# EasyEDA Pro project ProPrj_PCB_PCB_PCB_PCB_STM32F103C8T6(gift)_2023-09-09_2023-10-22_2024-01-15_2025-05-12.epro, schematic Schematic1
Board Name: 底板; Create Date: 2025-03-19; Page Name: P1; Project Name: PCB_PCB_PCB_PCB_STM32F103C8T6(gift)_2023-09-09_2023-10-22_2024-01-15; Schematic Name: Schematic1; Update Date: 2025-03-19; Company: Matrixchung; Page Size: Custom; Version: V1.0
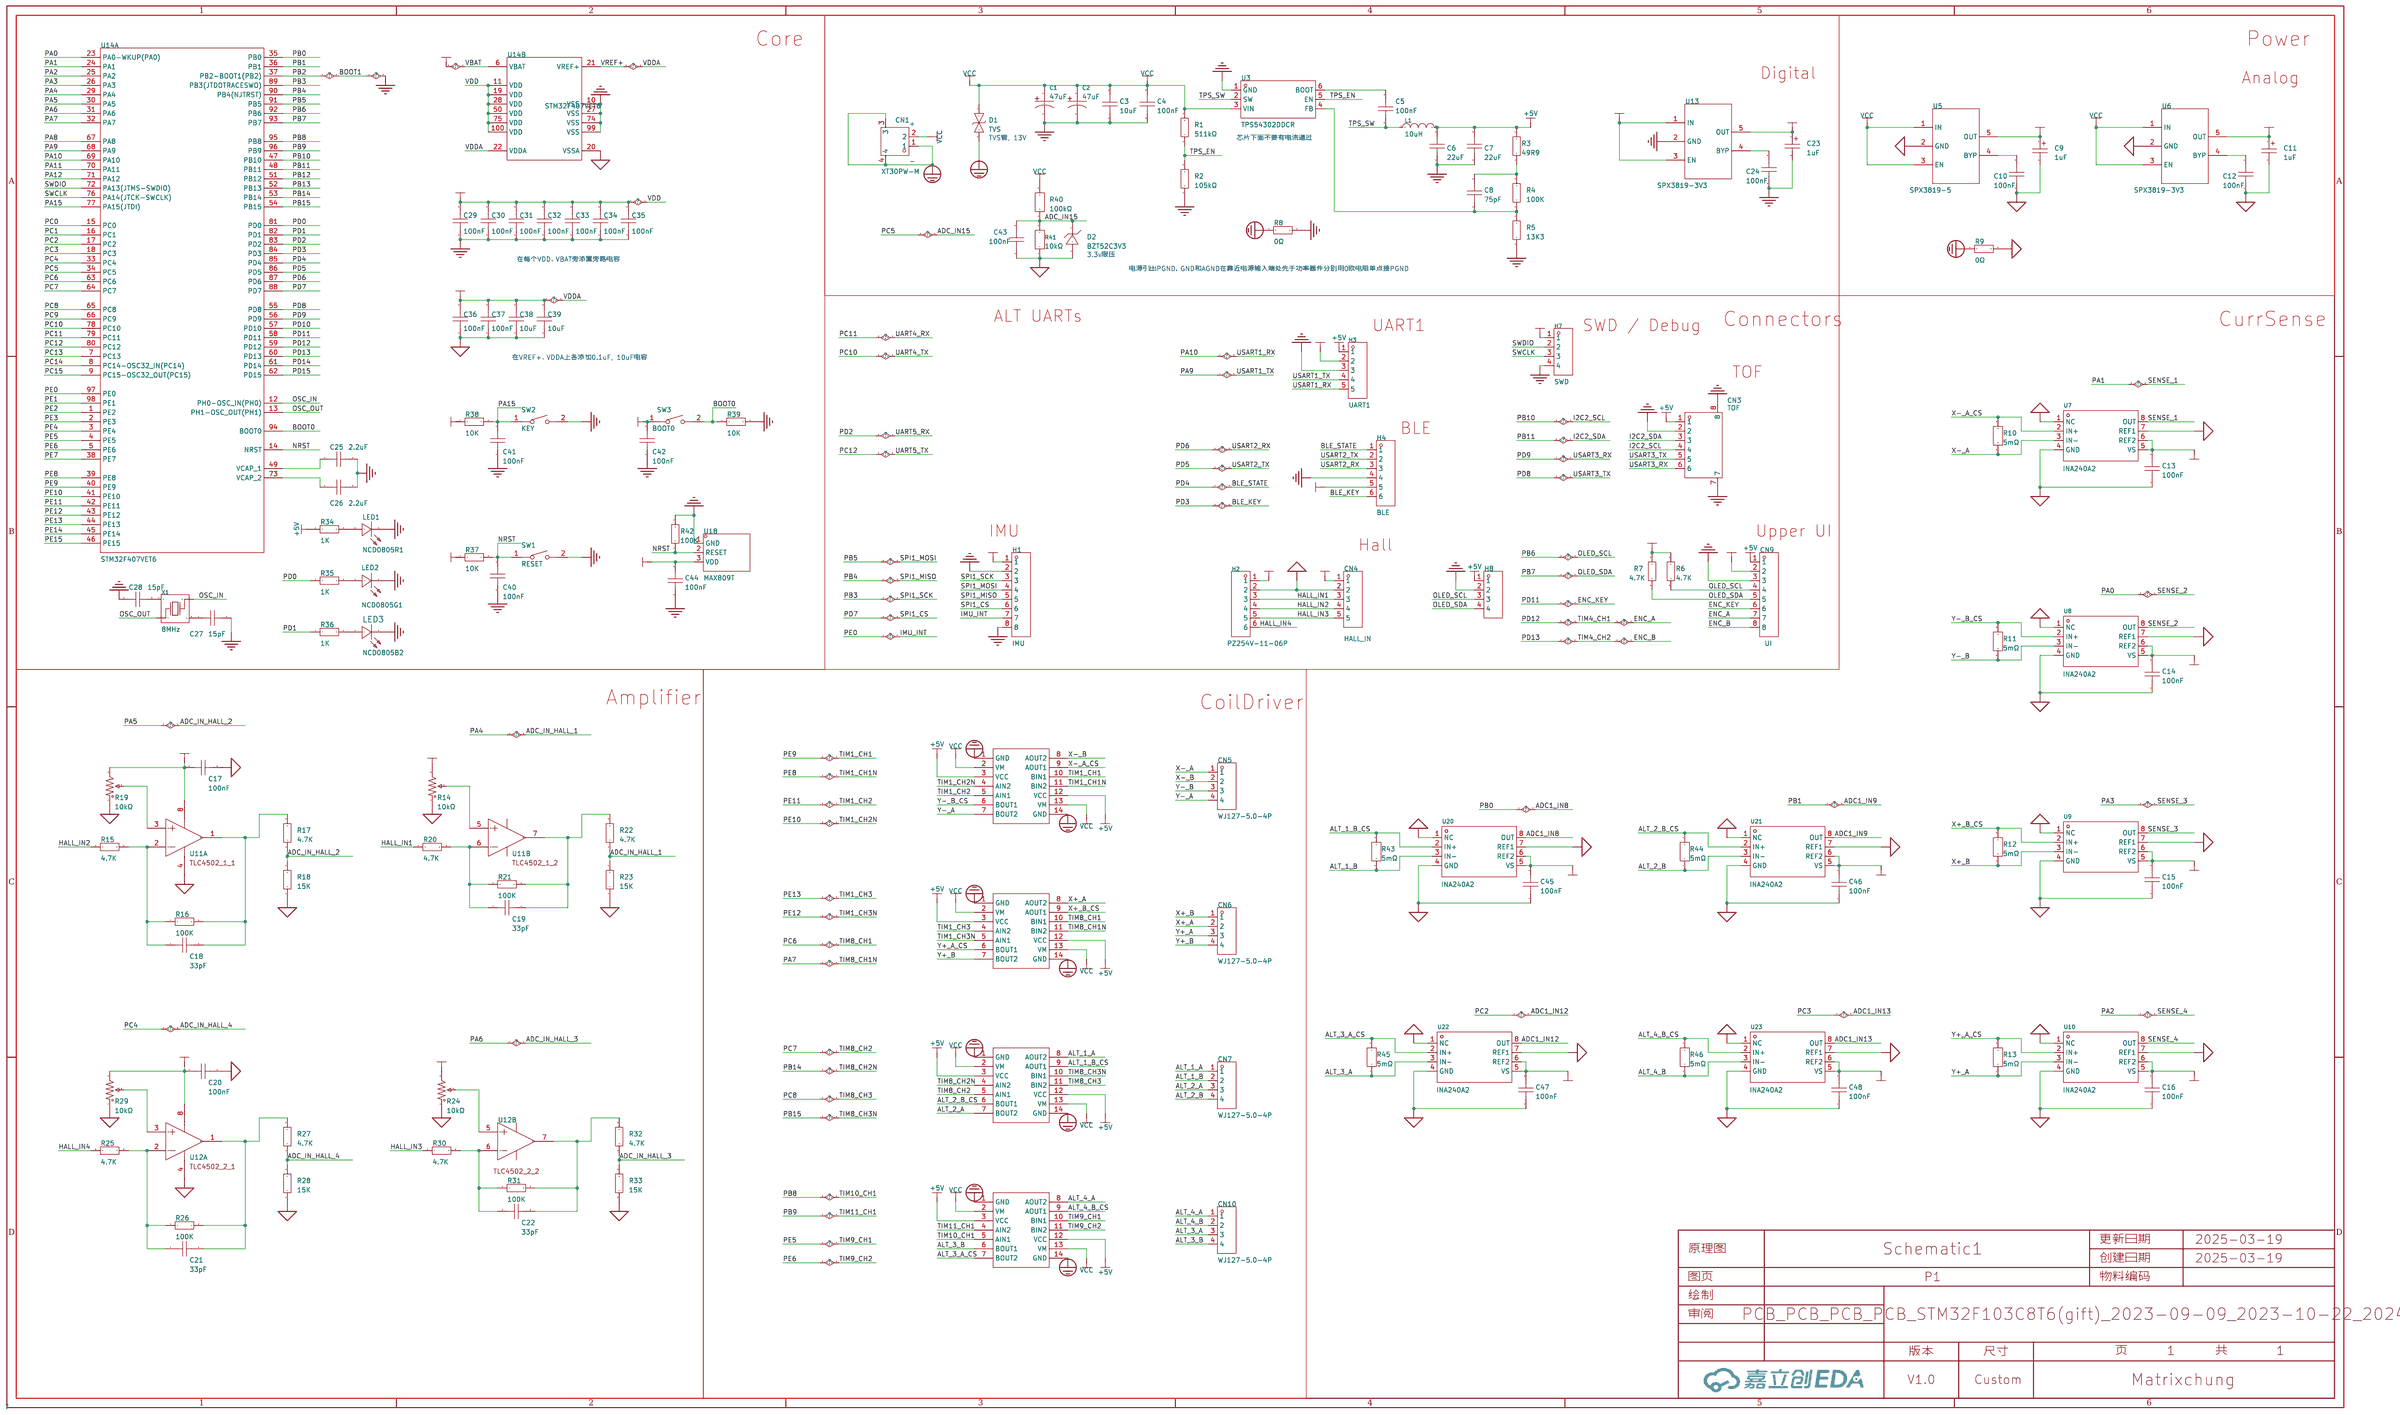
[diagram p0: schematic sheet]

## Parts
C1  47uF  [CAP-SMD_BD6.3-L6.6-W6.6-LS7.6-FD]
C2  47uF  [CAP-SMD_BD6.3-L6.6-W6.6-LS7.6-FD]
C3  10uF  [C0603]
C4  100nF  [C0603]
C5  100nF  [C0603]
C6  22uF  [C0603]
C7  22uF  [C0603]
C8  75pF  [C0603]
C9  1uF  [CASE-A_3216]
C10  100nF  [C0603]
C11  1uF  [CASE-A_3216]
C12  100nF  [C0603]
C13  100nF  [C0603]
C14  100nF  [C0603]
C15  100nF  [C0603]
C16  100nF  [C0603]
C17  100nF  [C0603]
C18  33pF  [C0603]
C19  33pF  [C0603]
C20  100nF  [C0603]
C21  33pF  [C0603]
C22  33pF  [C0603]
C23  1uF  [CASE-A_3216]
C24  100nF  [C0603]
C25  2.2uF  [C0603]
C26  2.2uF  [C0603]
C27  15pF  [C0603]
C28  15pF  [C0603]
C29  100nF  [C0603]
C30  100nF  [C0603]
C31  100nF  [C0603]
C32  100nF  [C0603]
C33  100nF  [C0603]
C34  100nF  [C0603]
C35  100nF  [C0603]
C36  100nF  [C0603]
C37  100nF  [C0603]
C38  10uF  [C0603]
C39  10uF  [C0603]
C40  100nF  [C0603]
C41  100nF  [C0603]
C42  100nF  [C0603]
C43  100nF  [C0603]
C44  100nF  [C0603]
C45  100nF  [C0603]
C46  100nF  [C0603]
C47  100nF  [C0603]
C48  100nF  [C0603]
CN1  XT30PW-M  [CONN-TH_XT30PW-M]
CN3  TOF  [CONN-SMD_A1002WV-S-6P]
CN4  HALL_IN  [CONN-TH_5P-P2.50_HC-XHB-5A]
CN5  WJ127-5.0-4P  [CONN-TH_4P-P5.00_WJ127-5.0-4P]
CN6  WJ127-5.0-4P  [CONN-TH_4P-P5.00_WJ127-5.0-4P]
CN7  WJ127-5.0-4P  [CONN-TH_4P-P5.00_WJ127-5.0-4P]
CN9  UI  [CONN-TH_8P-P2.50_HCTL_HC-XHB-8A]
CN10  WJ127-5.0-4P  [CONN-TH_4P-P5.00_WJ127-5.0-4P]
D1  TVS  [SMB_L4.6-W3.6-LS5.4-BI]
D2  BZT52C3V3  [SOD-123_L2.7-W1.6-LS3.7-RD]
H1  IMU  [HDR-TH_8P-P2.54-V-F-3]
H2  PZ254V-11-06P  [HDR-TH_6P-P2.54-V-M]
H3  UART1  [HDR-TH_5P-P2.54-V-M]
H4  BLE  [HDR-TH_6P-P2.54-V-F]
H7  SWD  [HDR-TH_4P-P2.54-V-M]
H8  MF254V-11-04-1000-H70  [HDR-TH_4P-P2.54-V-F-3]
L1  10uH  [IND-SMD_L5.4-W5.2_FXL0530]
LED1  NCD0805R1  [LED0805-R-RD]
LED2  NCD0805G1  [LED0805-R-RD]
LED3  NCD0805B2  [LED0805-R-RD]
R1  511kΩ  [R0805]
R2  105kΩ  [R0805]
R3  49R9  [R0603]
R4  100K  [R0603]
R5  13K3  [R0603]
R6  4.7K  [R0603]
R7  4.7K  [R0603]
R8  0Ω  [R2512]
R9  0Ω  [R2512]
R10  5mΩ  [R2512]
R11  5mΩ  [R2512]
R12  5mΩ  [R2512]
R13  5mΩ  [R2512]
R14  10kΩ  [RES-ADJ-TH_3P-L10.0-W10.0-P2.50-L]
R15  4.7K  [R0603]
R16  100K  [R0603]
R17  4.7K  [R0603]
R18  15K  [R0603]
R19  10kΩ  [RES-ADJ-TH_3P-L10.0-W10.0-P2.50-L]
R20  4.7K  [R0603]
R21  100K  [R0603]
R22  4.7K  [R0603]
R23  15K  [R0603]
R24  10kΩ  [RES-ADJ-TH_3P-L10.0-W10.0-P2.50-L]
R25  4.7K  [R0603]
R26  100K  [R0603]
R27  4.7K  [R0603]
R28  15K  [R0603]
R29  10kΩ  [RES-ADJ-TH_3P-L10.0-W10.0-P2.50-L]
R30  4.7K  [R0603]
R31  100K  [R0603]
R32  4.7K  [R0603]
R33  15K  [R0603]
R34  1K  [R0603]
R35  1K  [R0603]
R36  1K  [R0603]
R37  10K  [R0603]
R38  10K  [R0603]
R39  10K  [R0603]
R40  100kΩ  [R0805]
R41  10kΩ  [R0603]
R42  100K  [R0603]
R43  5mΩ  [R2512]
R44  5mΩ  [R2512]
R45  5mΩ  [R2512]
R46  5mΩ  [R2512]
SW1  RESET  [SW-SMD_L3.9-W3.0-P4.45]
SW2  KEY  [SW-SMD_L3.9-W3.0-P4.45]
SW3  BOOT0  [SW-SMD_L3.9-W3.0-P4.45]
U3  TPS54302DDCR  [SOT-23-6_L2.9-W1.6-P0.95-LS2.8-BL]
U5  SPX3819-5  [SOT-23-5_L3.0-W1.7-P0.95-LS2.8-BL]
U6  SPX3819-3V3  [SOT-23-5_L3.0-W1.7-P0.95-LS2.8-BL]
U7  INA240A2  [TSSOP-8_L4.4-W3.0-P0.65-LS6.4-BL]
U8  INA240A2  [TSSOP-8_L4.4-W3.0-P0.65-LS6.4-BL]
U9  INA240A2  [TSSOP-8_L4.4-W3.0-P0.65-LS6.4-BL]
U10  INA240A2  [TSSOP-8_L4.4-W3.0-P0.65-LS6.4-BL]
U11  -  [DIP-8_L10.2-W10.2-P2.54-LS7.6-BL]  (sections 1,2)
U12  -  [DIP-8_L10.2-W10.2-P2.54-LS7.6-BL]  (sections 1,2)
U13  SPX3819-3V3  [SOT-23-5_L3.0-W1.7-P0.95-LS2.8-BL]
U14  STM32F407VET6  [LQFP-100_L14.0-W14.0-P0.50-LS16.0-BL]  (sections 1,2)
U15  AT8236  [AT8236-Dual-Module]
U16  AT8236  [AT8236-Dual-Module]
U17  AT8236  [AT8236-Dual-Module]
U18  MAX809T  [SOT-23-3_L2.9-W1.3-P1.90-LS2.4-BR]
U19  AT8236  [AT8236-Dual-Module]
U20  INA240A2  [TSSOP-8_L4.4-W3.0-P0.65-LS6.4-BL]
U21  INA240A2  [TSSOP-8_L4.4-W3.0-P0.65-LS6.4-BL]
U22  INA240A2  [TSSOP-8_L4.4-W3.0-P0.65-LS6.4-BL]
U23  INA240A2  [TSSOP-8_L4.4-W3.0-P0.65-LS6.4-BL]
X1  8MHz  [OSC-SMD_4P-L3.2-W2.5-BL]

## Library data of the parts
C1 C2 = VT1V470M0605: 容值:47uF;精度:±20%;额定电压:35V;纹波电流:66mA@120Hz;等效串联电阻:-;; LCSC Part Name: 47uF ±20% 35V; Supplier Part: C90276; Manufacturer: ROQANG(容强); Supplier Footprint: SMD,D6.3xL5.4mm; JLCPCB Part Class: 扩展库; Datasheet: https://atta.szlcsc.com/upload/public/pdf/source/20161207/1481104186053.pdf; Supplier: LCSC; Tolerance: ±20%; Rated Voltage: 35V; φD: 6.3mm; L: 5.4mm; Ripple Current: 66mA@120Hz; Lifetime @ Temp: 2000hrs@105℃; Operating Temperature: -40℃~+105℃
C3-C8 C10 C12-C22 C24-C48 = CAP_0603: Supplier Footprint: 0603
C9 C11 C23 = TAJA105K016RNJ: 容值:1uF;精度:±10%;额定电压:16V;等效串联电阻:11Ω;; LCSC Part Name: 1uF ±10% 16V; Supplier Part: C7174; Manufacturer: Kyocera AVX; Supplier Footprint: CASE-A-3216; JLCPCB Part Class: 扩展库; Datasheet: https://atta.szlcsc.com/upload/public/pdf/source/20160107/1457707748219.pdf; Supplier: LCSC; Tolerance: ±10%; Rated Voltage: 16V; Equivalent Series Resistance(ESR): 11Ω; Operating Temperature: -55℃~+125℃
CN1 = XT30PW-M: Socket,DCsupply,XT30,male,PIN:2; LCSC Part Name: AMASS(艾迈斯)航模插头 卧式弯脚 XT30PW-M公头; Supplier Part: C431092; Manufacturer: AMASS(艾迈斯); JLCPCB Part Class: 扩展库; Datasheet: https://atta.szlcsc.com/upload/public/pdf/source/20220222/6A9F22F7850E25B33E1BE430ADF8560B.pdf; Supplier: LCSC
CN3 = A1002WV-S-6P: 参考系列:SH;间距:1mm;插针结构:1x6P;排数:1;每排PIN数:6;行距:-;安装方式:-;触头材质:磷青铜;; LCSC Part Name: SH 1mm 1x6P; Supplier Part: C239515; Manufacturer: CJT(长江连接器); Supplier Footprint: SMD,P=1mm; JLCPCB Part Class: 扩展库; Datasheet: https://atta.szlcsc.com/upload/public/pdf/source/20180724/C239515_C43A92B394FC8B21A6179F92F5D096DA.pdf; Supplier: LCSC; Reference Series: SH; Pitch: 1mm; Pins Structure: 1x6P; Number of Rows: 1; Number of PINs Per Row: 6; Contact Material: 磷青铜
CN4 = HC-XHB-5A: 参考系列:-;间距:2.5mm;插针结构:1x5P;排数:1;每排PIN数:5;行距:-;公母:公型插针;安装方式:直插;额定电流:3A;工作温度范围:-25℃~+85℃;; LCSC Part Name: 2.54带锁扣立式插件 5P 针座连接器线对板/线对线连接器; Supplier Part: C2845493; Manufacturer: HCTL(华灿天禄); Supplier Footprint: 插件,P=2.5mm; JLCPCB Part Class: 扩展库; Datasheet: https://atta.szlcsc.com/upload/public/pdf/source/20210728/C2845490_C6E0123D5C5ECC46C6D4C91ADB43F484.pdf; Supplier: LCSC; Pitch: 2.5mm; Pins Structure: 1x5P; Number of Rows: 1; Number of PINs Per Row: 5; Gender: 公型插针; Mounting Style: 直插; Current Rating (Max): 3A; Operating Temperature Range: -25℃~+85℃
CN5-CN7 CN10 = WJ127-5.0-4P: 间距:5mm;排数:1;每排PIN数:4;安装方式:直针;额定电流:15A;额定电压:250V;线规 - AWG:14~26;线规 - mm?:1.5;工作温度范围:-40℃~+105℃;颜色:绿色;; LCSC Part Name: 5mm 排数:1 每排P数:4 直针 可拼接; Supplier Part: C192779; Manufacturer: KANGNEX(康奈克斯电气); Supplier Footprint: 直插,P=5mm; JLCPCB Part Class: Extended Part; Datasheet: https://atta.szlcsc.com/upload/public/pdf/source/20191225/C192779_DBD79F61C9FABD31EC3EFBBD98D95251.pdf; Supplier: LCSC; Pitch: 5mm; Number of Rows: 1; Number of PINs Per Row: 4; Mounting Style: 直针; Current Rating (Max): 15A; Voltage Rating (Max): 250V; Wire Gauge - AWG: 14~26; Wire Gauge - mm?: 1.5; Operating Temperature Range: -40℃~+105℃; Color: 绿色
CN9 = HC-XHB-8A: 参考系列:-;间距:2.5mm;插针结构:1x8P;排数:1;每排PIN数:8;行距:-;公母:公型插针;安装方式:直插;额定电流:3A;工作温度范围:-25℃~+85℃;; LCSC Part Name: 2.54带锁扣立式插件 8P 针座连接器线对板/线对线连接器; Supplier Part: C2845496; Manufacturer: HCTL(华灿天禄); Supplier Footprint: 插件,P=2.5mm; JLCPCB Part Class: Extended Part; Datasheet: https://atta.szlcsc.com/upload/public/pdf/source/20210728/C2845490_C6E0123D5C5ECC46C6D4C91ADB43F484.pdf; Supplier: LCSC; Pitch: 2.5mm; Pins Structure: 1x8P; Number of Rows: 1; Number of PINs Per Row: 8; Gender: 公型插针; Mounting Style: 直插; Current Rating (Max): 3A; Operating Temperature Range: -25℃~+85℃
D1 = SMBJ13CA_C908846: 极性:双向;反向截止电压(Vrwm):13V;击穿电压(最小值):14.4V;击穿电压(最大值):16.5V;反向漏电流(Ir):5μA;峰值脉冲电流(Ipp)@10/1000μs:27.9A;最大钳位电压:21.5V;; LCSC Part Name: 双向 Vrwm:13V; Supplier Part: C908846; Manufacturer: GOODWORK(固得沃克); Manufacturer Part: SMBJ13CA; Supplier Footprint: SMB(DO-214AA); JLCPCB Part Class: Extended Part; Datasheet: https://atta.szlcsc.com/upload/public/pdf/source/20201231/C908783_5F0AE07776753216FC0A4122EEBBB8E2.pdf; Supplier: LCSC; Polarity: 双向; Reverse Stand-Off Voltage (Vrwm): 13V; Breakdown Voltage (Min): 14.4V; Breakdown Voltage (Max): 16.5V; Reverse Leakage Current (Ir): 5μA; Peak Pulse Current (Ipp)@10/1000μs: 27.9A; Maximum Clamping Voltage: 21.5V
D2 = BZT52C3V3_C173413: 二极管配置:独立式;稳压值(标称值):3.3V;稳压值(范围):3.1V~3.5V;精度:-;功率:500mW;; LCSC Part Name: 500mW 3.3V 稳压二极管 5%; Supplier Part: C173413; Manufacturer: MDD; Supplier Footprint: SOD-123; JLCPCB Part Class: Extended Part; Datasheet: https://atta.szlcsc.com/upload/public/pdf/source/20190118/C364303_B79676A2F6BCDB14D56544F3D9B288EE.pdf; Supplier: LCSC; Diode Configuration: 独立式; Zener Voltage (Nom): 3.3V; Zener Voltage (Range): 3.1V~3.5V; Power Dissipation: 500mW; Reverse Leakage Current (Ir): 5uA@1V; Zener Impedance (Zzt): 95Ω
H1 = MF254V-11-08-1000-H70: 排数:单排;总孔位数:8P;间距:2.54mm;插孔结构:1x8P;行距:-;安装类型:直插;圆孔/方孔:圆孔;额定电流:3A;额定电压:60V;插孔方向:顶部;塑高:7mm;工作温度范围:-40℃~+105℃;; LCSC Part Name: 间距:2.54mm 1x8P 直插; Supplier Part: C2848409; Manufacturer: XFCN(兴飞); Supplier Footprint: 插件,P=2.54mm; JLCPCB Part Class: 扩展库; Datasheet: https://atta.szlcsc.com/upload/public/pdf/source/20210721/C2848409_89F413CEA41E720CBF28B0BFB1F4009A.pdf; Supplier: LCSC; Number of Rows: 单排; Number of Holes: 8P; Pitch: 2.54mm; Holes Structure: 1x8P; Mounting Type: 直插; Circular Hole / Square Hole: 圆孔; Current Rating (Max): 3A; Voltage Rating (Max): 60V; Holes Direction: 顶部; Insulation Height: 7mm; Operating Temperature Range: -40℃~+105℃
H2 = PZ254V-11-06P: 排数:单排;总PIN位数:6;间距:2.54mm;插针结构:1x6P;行距:-;安装类型:直插;圆针/方针:方针;额定电流:-;额定电压:-;配合针长度:6mm;塑高:2.5mm;端接针长度:3mm;触头材质:黄铜;触头镀层:-;工作温度范围:-40℃~+105℃;颜色:黑色;; LCSC Part Name: 2.54mm 1x6P 直插 方针; Supplier Part: C492405; Manufacturer: XFCN(兴飞); Supplier Footprint: 直插,P=2.54mm; JLCPCB Part Class: Extended Part; Supplier: LCSC; Number of Rows: 单排; Number of Pins: 6; Pitch: 2.54mm; Pin Structure: 1x6P; Mounting Type: 直插; Circluar Pins/Square Pins: 方针; Length of Mating Pin: 6mm; Insulation Height: 2.5mm; Length of End Connection Pin: 3mm; Contact Material: 黄铜; Operating Temperature Range: -40℃~+105℃; Color: 黑色
H3 = PZ254V-11-05P: 排数:单排;总PIN位数:5P;间距:2.54mm;插针结构:1x5P;行距:-;安装类型:直插;圆针/方针:方针;额定电流:-;额定电压:-;配合针长度:6mm;塑高:2.5mm;端接针长度:3mm;触头材质:黄铜;触头镀层:-;工作温度范围:-40℃~+105℃;颜色:黑色;; LCSC Part Name: 2.54mm 1x5P 直插 方针; Supplier Part: C492404; Manufacturer: XFCN(兴飞); Supplier Footprint: 插件,P=2.54mm; JLCPCB Part Class: Extended Part; Datasheet: https://atta.szlcsc.com/upload/public/pdf/source/20200309/C492404_E51533260F8710EFF5D4617281164C1D.pdf; Supplier: LCSC; Number of Rows: 单排; Number of Pins: 5P; Pitch: 2.54mm; Pin Structure: 1x5P; Mounting Type: 直插; Circluar Pins/Square Pins: 方针; Length of Mating Pin: 6mm; Insulation Height: 2.5mm; Length of End Connection Pin: 3mm; Contact Material: 黄铜; Operating Temperature Range: -40℃~+105℃; Color: 黑色
H4 = PM254V-11-06-H85: 排数:单排;总孔位数:6P;间距:2.54mm;插孔结构:1x6P;行距:-;安装类型:直插;圆孔/方孔:方孔;额定电流:3A;额定电压:250V;插孔方向:顶部;塑高:-;工作温度范围:-40℃~+105℃;; LCSC Part Name: 间距:2.54mm 1x6P 直插; Supplier Part: C2832269; Manufacturer: XFCN(兴飞); Supplier Footprint: 插件,P=2.54mm; JLCPCB Part Class: Extended Part; Datasheet: https://atta.szlcsc.com/upload/public/pdf/source/20210514/C2832269_B3EC97736B37C2783BDCE3050AA57447.pdf; Supplier: LCSC; Number of Rows: 单排; Number of Holes: 6P; Pitch: 2.54mm; Holes Structure: 1x6P; Mounting Type: 直插; Circular Hole / Square Hole: 方孔; Current Rating (Max): 3A; Voltage Rating (Max): 250V; Holes Direction: 顶部; Operating Temperature Range: -40℃~+105℃
H7 = PZ254V-11-04P: 排数:单排;总PIN位数:4P;间距:2.54mm;插针结构:1x4P;行距:-;安装类型:直插;圆针/方针:方针;额定电流:3A;额定电压:250V;配合针长度:6mm;塑高:2.5mm;端接针长度:3mm;触头材质:-;工作温度范围:-40℃~+105℃;颜色:黑色;; LCSC Part Name: 2.54mm 1x4P 直插 方针; Supplier Part: C2691448; Manufacturer: XFCN(兴飞); Supplier Footprint: 插件,P=2.54mm; JLCPCB Part Class: 扩展库; Datasheet: https://atta.szlcsc.com/upload/public/pdf/source/20200309/C492403_F9F19131791D08044AD4F84F8E751A34.pdf; Supplier: LCSC; Number of Rows: 单排; Number of Pins: 4P; Pitch: 2.54mm; Pin Structure: 1x4P; Mounting Type: 直插; Circluar Pins/Square Pins: 方针; Current Rating (Max): 3A; Voltage Rating (Max): 250V; Length of Mating Pin: 6mm; Insulation Height: 2.5mm; Length of End Connection Pin: 3mm; Operating Temperature Range: -40℃~+105℃; Color: 黑色
H8 = MF254V-11-04-1000-H70: 排数:单排;总孔位数:4P;间距:2.54mm;插孔结构:1x4P;行距:-;安装类型:直插;圆孔/方孔:圆孔;额定电流:3A;额定电压:60V;插孔方向:顶部;塑高:7mm;工作温度范围:-40℃~+105℃;; LCSC Part Name: 间距:2.54mm 1x4P 直插; Supplier Part: C2848405; Manufacturer: XFCN(兴飞); Supplier Footprint: 插件,P=2.54mm; JLCPCB Part Class: 扩展库; Datasheet: https://atta.szlcsc.com/upload/public/pdf/source/20210721/C2848405_352A14CFBCEB0D6EF4850089E8881654.pdf; Supplier: LCSC; Number of Rows: 单排; Number of Holes: 4P; Pitch: 2.54mm; Holes Structure: 1x4P; Mounting Type: 直插; Circular Hole / Square Hole: 圆孔; Current Rating (Max): 3A; Voltage Rating (Max): 60V; Holes Direction: 顶部; Insulation Height: 7mm; Operating Temperature Range: -40℃~+105℃
L1 = FXL0530-100-M: 电感值:10uH;精度:±20%;额定电流:3.2A;饱和电流(Isat):3.5A;; LCSC Part Name: 10uH ±20% 3.2A 110mΩ; Supplier Part: C177248; Manufacturer: cjiang(长江微电); Supplier Footprint: SMD,5.4x5.2x2.8mm; JLCPCB Part Class: 扩展库; Supplier: LCSC; Tolerance: ±20%; Rated Current: 3.2A; Saturation Current (Isat): 3.5A; DC Resistance (DCR): 110mΩ
LED1 = NCD0805R1: 发光颜色:红灯;; LCSC Part Name: 红灯; Supplier Part: C84256; Manufacturer: 国星光电; Supplier Footprint: 0805; JLCPCB Part Class: Basic Part; Datasheet: https://atta.szlcsc.com/upload/public/pdf/source/20200820/C84256_F0A75A43B3EAD75808600A0514C76B99.pdf; Supplier: LCSC; Emitted Color: 红灯
LED2 = NCD0805G1: 发光颜色:翠绿;; LCSC Part Name: 翠绿 0805翠绿  正贴; Supplier Part: C84260; Manufacturer: 国星光电; Supplier Footprint: 0805; JLCPCB Part Class: Extended Part; Datasheet: https://atta.szlcsc.com/upload/public/pdf/source/20200820/C84260_AFC7BF57C6FBA034D182BB8D10A67EFE.pdf; Supplier: LCSC; Emitted Color: 翠绿
LED3 = NCD0805B2: 发光颜色:蓝灯;; LCSC Part Name: 蓝灯 0805蓝灯   正贴; Supplier Part: C84259; Manufacturer: 国星光电; Supplier Footprint: 0805; JLCPCB Part Class: Extended Part; Datasheet: https://atta.szlcsc.com/upload/public/pdf/source/20200820/C84259_E5AC6865415989C4C2C2831134BA3A23.pdf; Supplier: LCSC; Emitted Color: 蓝灯
R1 = 0805W8F5113T5E: 电阻类型:厚膜电阻;阻值:511kΩ;精度:±1%;功率:125mW;; LCSC Part Name: 511kΩ ±1% 125mW; Supplier Part: C17735; Manufacturer: UNI-ROYAL(厚声); Supplier Footprint: 0805; JLCPCB Part Class: Extended Part; Datasheet: https://atta.szlcsc.com/upload/public/pdf/source/20200306/C422600_1E6D84923E4A46A82E41ADD87F860B5C.pdf; Supplier: LCSC; Type: 厚膜电阻; Tolerance: ±1%; Power(Watts): 125mW; Temperature Coefficient: ±100ppm/℃; Overload Voltage (Max): 150V; Operating Temperature Range: -55℃~+155℃
R2 = 0805W8F1053T5E: 电阻类型:厚膜电阻;阻值:105kΩ;精度:±1%;功率:125mW;; LCSC Part Name: 105kΩ ±1% 125mW; Supplier Part: C17410; Manufacturer: UNI-ROYAL(厚声); Supplier Footprint: 0805; JLCPCB Part Class: Extended Part; Datasheet: https://atta.szlcsc.com/upload/public/pdf/source/20200306/C422600_1E6D84923E4A46A82E41ADD87F860B5C.pdf; Supplier: LCSC; Type: 厚膜电阻; Tolerance: ±1%; Power(Watts): 125mW; Temperature Coefficient: ±100ppm/℃; Overload Voltage (Max): 150V; Operating Temperature Range: -55℃~+155℃
R3-R7 R15-R18 R20-R23 R25-R28 R30-R39 R42 = Res_0603: Supplier Footprint: 0603
R8 R9 = 25121WF0000T4E: 电阻类型:厚膜电阻;阻值:0Ω;精度:±1%;功率:1W;; LCSC Part Name: 0Ω ±1% 1W; Supplier Part: C270957; Manufacturer: UNI-ROYAL(厚声); Supplier Footprint: 2512; JLCPCB Part Class: Extended Part; Datasheet: https://atta.szlcsc.com/upload/public/pdf/source/20200306/C422600_1E6D84923E4A46A82E41ADD87F860B5C.pdf; Supplier: LCSC; Type: 厚膜电阻; Tolerance: ±1%; Power(Watts): 1W; Temperature Coefficient: ±800ppm/℃; Overload Voltage (Max): 200V; Operating Temperature Range: -55℃~+155℃
R10-R13 R43-R46 = LR2512D-3W-5mR-1%: 阻值:5mΩ;精度:±1%;功率:3W;; LCSC Part Name: 5mΩ ±1% 3W; Supplier Part: C500739; Manufacturer: Milliohm(毫欧); Supplier Footprint: 2512; JLCPCB Part Class: Extended Part; Datasheet: https://atta.szlcsc.com/upload/public/pdf/source/20211008/27BCB003066C6550DC06C87D8395239C.pdf; Supplier: LCSC; Tolerance: ±1%; Power(Watts): 3W; Temperature Coefficient: 25ppm/℃~+50ppm/℃
R14 R19 R24 R29 = 3296W-1-103: 阻值:10kΩ;精度:±10%;; LCSC Part Name: 10kΩ ±10%; Supplier Part: C118954; Manufacturer: BOCHEN(博晨); Supplier Footprint: 插件; JLCPCB Part Class: 扩展库; Datasheet: https://atta.szlcsc.com/upload/public/pdf/source/20171114/C118954_15106326646611117443.pdf; Supplier: LCSC; Tolerance: ±10%
R40 = HoLTT0805-1/8W-100K-5%: 阻值:100kΩ;功率:125mW;; LCSC Part Name: 100kΩ 125mW; Supplier Part: C2904540; Manufacturer: Milliohm(毫欧); Supplier Footprint: 0805; JLCPCB Part Class: Extended Part; Datasheet: https://atta.szlcsc.com/upload/public/pdf/source/20211021/528351F376078D6228C985A842C3763C.pdf; Supplier: LCSC; Power(Watts): 125mW
R41 = HoLTT0603-1/10W-10K-1%: 阻值:10kΩ;功率:100mW;; LCSC Part Name: 10kΩ 100mW; Supplier Part: C2904526; Manufacturer: Milliohm(毫欧); Supplier Footprint: 0603; JLCPCB Part Class: Extended Part; Datasheet: https://atta.szlcsc.com/upload/public/pdf/source/20211021/528351F376078D6228C985A842C3763C.pdf; Supplier: LCSC; Power(Watts): 100mW
SW1-SW3 = TS-1088-AR02016: 触点电流:50mA;额定电压(DC):12V;绝缘电阻:100MΩ;电路结构:单刀单掷;安装方式:立贴;作用力:160gf@±50gf;机械寿命:10万次;带支架:否;; LCSC Part Name: 4*3*2mm 立贴 轻触开关; Supplier Part: C720477; Manufacturer: XUNPU(讯普); Supplier Footprint: SMD; JLCPCB Part Class: 扩展库; Datasheet: https://atta.szlcsc.com/upload/public/pdf/source/20200810/C720475_60D09DD6C54279ADDB2DC25100F1CC11.pdf; Supplier: LCSC; Contact Current: 50mA; Voltage Rating (DC): 12V; Insulation Resistance: 100MΩ; Circuit: 单刀单掷; Mounting Style: 立贴; Actuator Style: 圆形按钮; Actuator/Cap Color: 黑色; Operating Force: 160gf@±50gf; Mechanical Life: 10万次; Operating Temperature: -30℃~+80℃; Pin Style: SMD接片; Switch Length: 4mm; Switch Width: 3mm; Switch Height: 2mm; Strike Gundam: 否
U3 = TPS54302DDCR: 功能类型:降压型;输出类型:可调;输入电压:4.5V~28V;输出电压:596mV~28V;输出电流(最大值):3A;; LCSC Part Name: 降压型 输入4.5V~28V 输出596mV~28V 3A; Supplier Part: C311983; Manufacturer: TI(德州仪器); Supplier Footprint: TSOT-23-6; JLCPCB Part Class: 扩展库; Datasheet: https://atta.szlcsc.com/upload/public/pdf/source/20181023/C311983_0948EE70BFAD2011B492BD3F4CEA709D.pdf; Supplier: LCSC; Function: 降压型; Synchronous Rectification: 是; Output Type: 可调; Number of Outputs: 1; Topology: 降压式; Input Voltage: 4.5V~28V; Output Voltage: 596mV~28V; Output Current (Max): 3A; Switching Frequency: 400kHz; Operating Temperature: -40℃~+125℃@(TJ)
U5 = SPX3819M5-L-5-0/TR: 输出类型:固定;输出极性:正;最大输入电压:16V;输出电压:5V;输出电流:500mA;电源纹波抑制比(PSRR):-;; Supplier Part: C13417; Manufacturer: MaxLinear; Supplier Footprint: SOT-23-5; JLCPCB Part Class: Extended Part; Datasheet: https://atta.szlcsc.com/upload/public/pdf/source/20150720/1457707331934.pdf; Supplier: LCSC; Output Type: 固定; Output Polarity: 正; Number of Outputs: 1; Maximum Input Voltage: 16V; Output Voltage: 5V; Dropout Voltage: 700mV@(500mA); Output Current: 500mA
U6 U13 = SPX3819M5-L-3-3/TR: 输出类型:固定;输出极性:正;最大输入电压:16V;输出电压:3.3V;输出电流:500mA;电源纹波抑制比(PSRR):70dB;; Supplier Part: C9055; Manufacturer: MaxLinear; Supplier Footprint: SOT-23-5; JLCPCB Part Class: Extended Part; Datasheet: https://atta.szlcsc.com/upload/public/pdf/source/20160421/1461205045150.pdf; Supplier: LCSC; Output Type: 固定; Output Polarity: 正; Number of Outputs: 1; Maximum Input Voltage: 16V; Output Voltage: 3.3V; Dropout Voltage: 700mV@(500mA); Output Current: 500mA; Power Supply Rejection Ratio (PSRR): 70dB
U7-U10 U20-U23 = INA240A2PWR: 通道数:1;; Supplier Part: C129949; Manufacturer: TI(德州仪器); Supplier Footprint: TSSOP-8; JLCPCB Part Class: 扩展库; Datasheet: https://www.ti.com/cn/lit/gpn/ina240; Supplier: LCSC; Number of Channels: 1; Supply Current: 1.8mA; Operating Temperature: -40℃~+125℃
U11 = 双通道运放/TR: 1; Supplier: LCSC; Supplier Part: C398078; Manufacturer: HGSEMI; Manufacturer Part: TLC4502_1_1
U12 = 双通道运放/TR: 1; Supplier: LCSC; Supplier Part: C398078; Manufacturer: HGSEMI; Manufacturer Part: TLC4502_2_1
U14 = STM32F407VET6: CPU内核:ARM Cortex-M4;CPU最大主频:168MHz;工作电压范围:1.8V~3.6V;内部振荡器:有;程序 FLASH容量:512K@x8bit;RAM总容量:192KB;EEPROM/数据 FLASH容量:-;GPIO端口数量:82;ADC(单元数/通道数/位数):1@x16ch/12bit;DAC(单元数/通道数/位数):1@x2ch/12bit;外设/功能/协议栈:欠压检测/复位；DMA；LCD驱动；看门狗；POR；PWM;工作温度范围:-40℃~+85℃;; LCSC Part Name: ARM Cortex-M4 168MHz 闪存：512K@x8bit RAM：192KB; Supplier Part: C28730; Manufacturer: ST(意法半导体); Supplier Footprint: LQFP-100(14x14); JLCPCB Part Class: 扩展库; Datasheet: https://atta.szlcsc.com/upload/public/pdf/source/20140322/1457707027869.pdf; Supplier: LCSC; CPU Core: ARM Cortex-M4; Maximum Frequency: 168MHz; Supply Voltage Range: 1.8V~3.6V; Internal Oscillator: 有; Program FLASH Size: 512K@x8bit; RAM Size: 192KB; GPIO Ports Number: 82; ADC (Units/Channels/bits): 1@x16ch/12bit; DAC (Units/Channels/bits): 1@x2ch/12bit; Peripherals / Functions / Protocol Stacks: 欠压检测/复位；DMA；LCD驱动；看门狗；POR；PWM; Operating Temperature Range: -40℃~+85℃
U15-U17 U19 = AT8236-Dual-Module
U18 = MAX809T: Supplier Part: C347372; Manufacturer: UMW(广东友台半导体); Supplier Footprint: SOT-23; JLCPCB Part Class: 扩展库; Datasheet: https://atta.szlcsc.com/upload/public/pdf/source/20211011/D71F333B2CEF1462994E4653FF931569.pdf; Supplier: LCSC
X1 = TAXM8M4RDBCCT2T: 频率:8MHz;频率公差:±10ppm;负载电容:10pF;; LCSC Part Name: 8MHz ±10ppm 10pF; Supplier Part: C400090; Manufacturer: TAE(雅晶鑫); Supplier Footprint: SMD3225-4P; JLCPCB Part Class: 扩展库; Datasheet: https://atta.szlcsc.com/upload/public/pdf/source/20190626/C400090_CF95B89E745AFE4EF2E392EF8AC009D6.pdf; Supplier: LCSC; Crystal Type: 贴片无源晶振; Frequency Tolerance: ±10ppm; Frequency Stability: ±15ppm; Load Capacitance: 10pF; Equivalent Series Resistance (ESR): 250Ω; Operating Temperature: -40℃~+85℃

## Nets
3V3: C23.1 C29.2 C30.2 C31.2 C32.2 C33.2 C34.2 C35.2 C42.2 C44.2 CN9.2 H1.1 H3.2 H4.5 H7.1 R6.2 R7.2 R37.1 R38.1 SW3.1 U13.5(OUT) U14.6(VBAT) U14.11(VDD) U14.19(VDD) U14.28(VDD) U14.50(VDD) U14.75(VDD) U14.100(VDD) U18.3(VDD)
+5V: C6.2 C7.2 CN3.1 CN9.1 H3.1 H8.1 L1.2 R3.2 R34.1 U13.1(IN) U13.3(EN) U15.3(VCC) U15.12(VCC) U16.3(VCC) U16.12(VCC) U17.3(VCC) U17.12(VCC) U19.3(VCC) U19.12(VCC)
A3V3: C11.1 C13.2 C14.2 C15.2 C16.2 C36.2 C37.2 C38.2 C39.2 C45.2 C46.2 C47.2 C48.2 U6.5(OUT) U7.5(VS) U7.6(REF2) U8.5(VS) U8.6(REF2) U9.5(VS) U9.6(REF2) U10.5(VS) U10.6(REF2) U14.21(VREF+) U14.22(VDDA) U20.5(VS) U20.6(REF2) U21.5(VS) U21.6(REF2) U22.5(VS) U22.6(REF2) U23.5(VS) U23.6(REF2)
AGND: C9.2 C10.1 C11.2 C12.1 C13.1 C14.1 C15.1 C16.1 C17.2 C20.2 C36.1 C37.1 C38.1 C39.1 C43.1 C45.1 C46.1 C47.1 C48.1 CN4.2 D2.2(A) H2.2 R9.2 R14.1 R18.1 R19.1 R23.1 R24.1 R28.1 R29.1 R33.1 R41.1 U5.2(GND) U6.2(GND) U7.1(NC) U7.4(GND) U7.7(REF1) U8.1(NC) U8.4(GND) U8.7(REF1) U9.1(NC) U9.4(GND) U9.7(REF1) U10.1(NC) U10.4(GND) U10.7(REF1) U11.4(GND) U12.4(GND) U14.20(VSSA) U20.1(NC) U20.4(GND) U20.7(REF1) U21.1(NC) U21.4(GND) U21.7(REF1) U22.1(NC) U22.4(GND) U22.7(REF1) U23.1(NC) U23.4(GND) U23.7(REF1)
GND: C1.2 C2.2 C3.1 C4.1 C6.1 C7.1 C23.2 C24.1 C25.2 C26.2 C27.2 C28.1 C29.1 C30.1 C31.1 C32.1 C33.1 C34.1 C35.1 C40.1 C41.1 C42.1 C44.1 CN3.2 CN3.7 CN3.8 CN9.3 H1.2 H1.8 H3.3 H4.4 H7.4 H8.2 LED1.2(-) LED2.2(K) LED3.2(-) R2.1 R5.1 R8.2 R39.2 R42.2 SW1.2 SW2.2 U3.1(GND) U13.2(GND) U14.10(VSS) U14.27(VSS) U14.37(PB2-BOOT1(PB2)) U14.74(VSS) U14.99(VSS) U18.1(GND)
PGND: CN1.1 CN1.3 CN1.4 D1.2 R8.1 R9.1 U15.1(GND) U15.14(GND) U16.1(GND) U16.14(GND) U17.1(GND) U17.14(GND) U19.1(GND) U19.14(GND)
VCC: C1.1 C2.1 C3.2 C4.2 CN1.2 D1.1 R1.2 R40.2 U3.3(VIN) U5.1(IN) U5.3(EN) U6.1(IN) U6.3(EN) U15.2(VM) U15.13(VM) U16.2(VM) U16.13(VM) U17.2(VM) U17.13(VM) U19.2(VM) U19.13(VM)
A+5V: C9.1 C17.1 C20.1 CN4.1 H2.1 R14.3 R19.3 R24.3 R29.3 U5.5(OUT) U11.8(VCC) U12.8(VCC)
ADC1_IN8: U14.35(PB0) U20.8(OUT)
ADC1_IN9: U14.36(PB1) U21.8(OUT)
ADC1_IN12: U14.17(PC2) U22.8(OUT)
ADC1_IN13: U14.18(PC3) U23.8(OUT)
ADC_IN15: C43.2 D2.1(K) R40.1 R41.2 U14.34(PC5)
ADC_IN_HALL_1: R22.1 R23.2 U14.29(PA4)
ADC_IN_HALL_2: R17.1 R18.2 U14.30(PA5)
ADC_IN_HALL_3: R32.1 R33.2 U14.31(PA6)
ADC_IN_HALL_4: R27.1 R28.2 U14.33(PC4)
ALT_1_A: CN7.1 U17.8(AOUT2)
ALT_1_B: CN7.2 R43.1 U20.3(IN-)
ALT_1_B_CS: R43.2 U17.9(AOUT1) U20.2(IN+)
ALT_2_A: CN7.3 U17.7(BOUT2)
ALT_2_B: CN7.4 R44.1 U21.3(IN-)
ALT_2_B_CS: R44.2 U17.6(BOUT1) U21.2(IN+)
ALT_3_A: CN10.3 R45.1 U22.3(IN-)
ALT_3_A_CS: R45.2 U19.7(BOUT2) U22.2(IN+)
ALT_3_B: CN10.4 U19.6(BOUT1)
ALT_4_A: CN10.1 U19.8(AOUT2)
ALT_4_B: CN10.2 R46.1 U23.3(IN-)
ALT_4_B_CS: R46.2 U19.9(AOUT1) U23.2(IN+)
BLE_KEY: H4.6 U14.84(PD3)
BLE_STATE: H4.1 U14.85(PD4)
BOOT0: R39.1 SW3.2 U14.94(BOOT0)
ENC_A: CN9.7 U14.59(PD12)
ENC_B: CN9.8 U14.60(PD13)
ENC_KEY: CN9.6 U14.58(PD11)
HALL_IN1: CN4.3 H2.3 R20.1
HALL_IN2: CN4.4 H2.4 R15.1
HALL_IN3: CN4.5 H2.5 R30.1
HALL_IN4: H2.6 R25.1
I2C2_SCL: CN3.4 U14.47(PB10)
I2C2_SDA: CN3.3 U14.48(PB11)
IMU_INT: H1.7 U14.97(PE0)
NRST: C40.2 R37.2 R42.1 SW1.1 U14.14(NRST) U18.2(RESET)
OLED_SCL: CN9.4 H8.3 R6.1 U14.92(PB6)
OLED_SDA: CN9.5 H8.4 R7.1 U14.93(PB7)
OSC_IN: U14.12(PH0-OSC_IN(PH0)) X1.3
OSC_OUT: U14.13(PH1-OSC_OUT(PH1)) X1.1
PA0: U8.8(OUT) U14.23(PA0-WKUP(PA0))
PA1: U7.8(OUT) U14.24(PA1)
PA2: U10.8(OUT) U14.25(PA2)
PA3: U9.8(OUT) U14.26(PA3)
PA7: U14.32(PA7) U16.11(BIN2)
PA8: U14.67(PA8)
PA9: H3.4 U14.68(PA9)
PA10: H3.5 U14.69(PA10)
PA11: U14.70(PA11)
PA12: U14.71(PA12)
PA15: C41.2 R38.2 SW2.1 U14.77(PA15(JTDI))
PB3: H1.3 U14.89(PB3(JTDOTRACESWO))
PB4: H1.5 U14.90(PB4(NJTRST))
PB5: H1.4 U14.91(PB5)
PB8: U14.95(PB8) U19.5(AIN1)
PB9: U14.96(PB9) U19.4(AIN2)
PB12: U14.51(PB12)
PB13: U14.52(PB13)
PB14: U14.53(PB14) U17.4(AIN2)
PB15: U14.54(PB15) U17.10(BIN1)
PC0: U14.15(PC0)
PC1: U14.16(PC1)
PC6: U14.63(PC6) U16.10(BIN1)
PC7: U14.64(PC7) U17.5(AIN1)
PC8: U14.65(PC8) U17.11(BIN2)
PC9: U14.66(PC9)
PC10: U14.78(PC10)
PC11: U14.79(PC11)
PC12: U14.80(PC12)
PC13: U14.7(PC13)
PC14: U14.8(PC14-OSC32_IN(PC14))
PC15: U14.9(PC15-OSC32_OUT(PC15))
PD0: R35.1 U14.81(PD0)
PD1: R36.1 U14.82(PD1)
PD2: U14.83(PD2)
PD5: H4.2 U14.86(PD5)
PD6: H4.3 U14.87(PD6)
PD7: H1.6 U14.88(PD7)
PD8: CN3.5 U14.55(PD8)
PD9: CN3.6 U14.56(PD9)
PD10: U14.57(PD10)
PD14: U14.61(PD14)
PD15: U14.62(PD15)
PE1: U14.98(PE1)
PE2: U14.1(PE2)
PE3: U14.2(PE3)
PE4: U14.3(PE4)
PE5: U14.4(PE5) U19.10(BIN1)
PE6: U14.5(PE6) U19.11(BIN2)
PE7: U14.38(PE7)
PE8: U14.39(PE8) U15.11(BIN2)
PE9: U14.40(PE9) U15.10(BIN1)
PE10: U14.41(PE10) U15.4(AIN2)
PE11: U14.42(PE11) U15.5(AIN1)
PE12: U14.43(PE12) U16.5(AIN1)
PE13: U14.44(PE13) U16.4(AIN2)
PE14: U14.45(PE14)
PE15: U14.46(PE15)
SWCLK: H7.3 U14.76(PA14(JTCK-SWCLK))
SWDIO: H7.2 U14.72(PA13(JTMS-SWDIO))
TPS_EN: R1.1 R2.2 U3.5(EN)
TPS_SW: C5.1 L1.1 U3.2(SW)
X+_A: CN6.2 U16.8(AOUT2)
X+_B: CN6.1 R12.1 U9.3(IN-)
X+_B_CS: R12.2 U9.2(IN+) U16.9(AOUT1)
X-_A: CN5.1 R10.1 U7.3(IN-)
X-_A_CS: R10.2 U7.2(IN+) U15.9(AOUT1)
X-_B: CN5.2 U15.8(AOUT2)
Y+_A: CN6.3 R13.1 U10.3(IN-)
Y+_A_CS: R13.2 U10.2(IN+) U16.6(BOUT1)
Y+_B: CN6.4 U16.7(BOUT2)
Y-_A: CN5.4 U15.7(BOUT2)
Y-_B: CN5.3 R11.1 U8.3(IN-)
Y-_B_CS: R11.2 U8.2(IN+) U15.6(BOUT1)
$1N1133: C5.2 U3.6(BOOT)
$1N1138: C8.2 R3.1 R4.2
$1N7509: C10.2 U5.4(BYP)
$1N7699: C12.2 U6.4(BYP)
$1N22323: R19.2 U11.3(1IN-)
$1N22620: C18.2 R16.2 R17.2 U11.1(1OUT)
$1N22630: C18.1 R15.2 R16.1 U11.2(1IN+)
$1N29992: R14.2 U11.5(2IN-)
$1N30121: C19.1 R20.2 R21.1 U11.6(2IN+)
$1N30128: C19.2 R21.2 R22.2 U11.7(2OUT)
$1N30459: R29.2 U12.3(1IN-)
$1N30463: C21.2 R26.2 R27.2 U12.1(1OUT)
$1N30464: C21.1 R25.2 R26.1 U12.2(1IN+)
$1N30664: R24.2 U12.5(2IN-)
$1N30669: C22.1 R30.2 R31.1 U12.6(2IN+)
$1N30675: C22.2 R31.2 R32.2 U12.7(2OUT)
$1N32047: C24.2 U13.4(BYP)
$1N42415: C25.1 U14.49(VCAP_1)
$1N42492: C26.1 U14.73(VCAP_2)
$1N42643: C28.2 X1.4
$1N42645: C27.1 X1.2
$1N44184: LED1.1(+) R34.2
$1N44282: LED2.1(A) R35.2
$1N44308: LED3.1(+) R36.2
$1N45688: C8.1 R4.1 R5.2 U3.4(FB)

## Notes on the sheet
- Core
- Power
- Digital
- Analog
- +
- TVS管, 13V
- 芯片下面不要有电流通过
- -
- 在每个VDD、VBAT旁添置旁路电容
- 3.3v限压
- 电源引出PGND，GND和AGND在靠近电源输入端处先于功率器件分别用0欧电阻单点接PGND
- ALT UARTs
- Connectors
- CurrSense
- UART1
- SWD / Debug
- 在VREF+、VDDA上各添加0.1uF, 10uF电容
- TOF
- BLE
- IMU
- Upper UI
- Hall
- Amplifier
- CoilDriver
